# Altium schematic sheet RS-485 Interface.SchDoc
size A; SheetNumber: 6; SheetTotal: 6
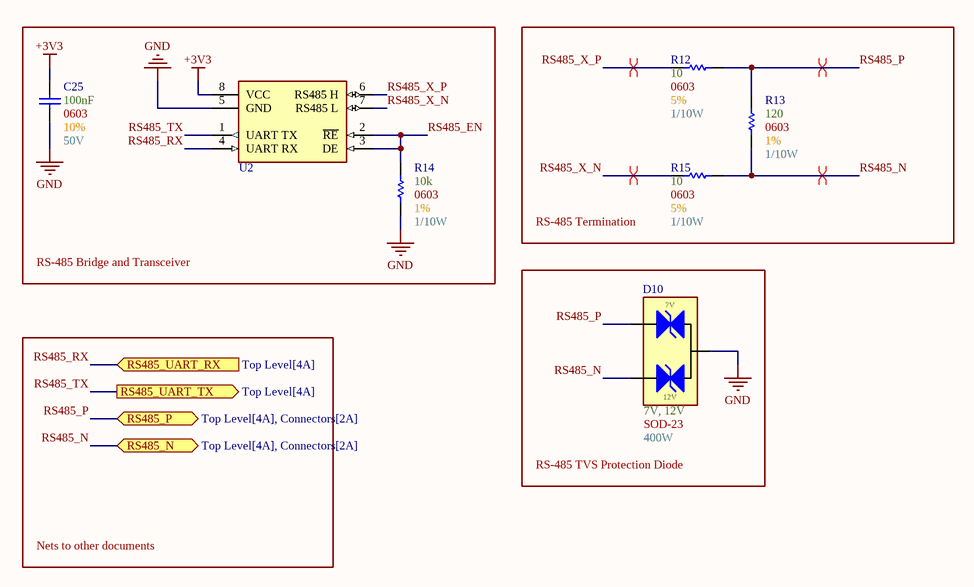
[diagram p0: RS-485 Interface.SchDoc]

## Parts
C25  Max Voltage: 50V  Size Package: 0603  Tolerance: 10%  Capacitance: 100nF  [[Cap] SMD 0603]  (hidden comment: [Cap] 0603 0.1uF 10% 50V)
D10  Wattage: 400W  Optimal Zener Voltage: 7V, 12V  [[Diode] SOD-23]  (hidden comment: SOD-23)
R12  Wattage: 1/10W  Tolerance: 5%  Resistance: 10  Size Package: 0603  [[Res] SMD 0603]  (hidden comment: [10] SMD 0603 5% 1/10W)
R13  Wattage: 1/10W  Tolerance: 1%  Resistance: 120  Size Package: 0603  [[Res] SMD 0603]  (hidden comment: [120] SMD 0603 1% 1/10W)
R14  Wattage: 1/10W  Tolerance: 1%  Resistance: 10k  Size Package: 0603  [[Res] SMD 0603]  (hidden comment: [10k] SMD 0603 1% 1/10W)
R15  Wattage: 1/10W  Tolerance: 5%  Resistance: 10  Size Package: 0603  [[Res] SMD 0603]  (hidden comment: [10] SMD 0603 5% 1/10W)
U2  [Bridge] UART-RS485  [8-SOIC]  (value not drawn)

## Blocks framed on the sheet
RS-485 Bridge and Transceiver: C25 R14 U2
RS-485 Termination: R12 R13 R15
RS-485 TVS Protection Diode: D10

## Ports
RS485_N (bidir, see Top Level[4A], Connectors[2A]), RS485_P (bidir, see Top Level[4A], Connectors[2A]), RS485_UART_RX (in, see Top Level[4A]), RS485_UART_TX (out, see Top Level[4A])

## Nets
+3V3: C25.2 U2.8(VCC)
GND: C25.1 D10.3 R14.1 U2.5(GND)
RS485_EN: R14.2 U2.2(~{RE}) U2.3(DE)
RS485_N: D10.2 R13.1 R15.1 ; port RS485_N
RS485_P: D10.1 R12.1 R13.2 ; port RS485_P
RS485_RX: U2.4(UART_RX) ; port RS485_UART_RX
RS485_TX: U2.1(UART_TX) ; port RS485_UART_TX
RS485_X_N: R15.2 U2.7(RS485_L)
RS485_X_P: R12.2 U2.6(RS485_H)

## Layout directives
differential pair: RS485_N, RS485_P, RS485_X_N, RS485_X_P

## Notes on the sheet
- Nets to other documents
- (in symbol [TVS] 7,12Vnom 11,19Vclamp_max) 7V; 12V

## Library data of the parts
C25 = [Cap] 0603 0.1uF 10% 50V: CL10B104KB8NNNC; Supplier 1: DigiKey; Supplier Part Number 1: 1276-1000-6-ND
D10 = [TVS] 7,12Vnom 11,19Vclamp_max: CDSOT23-SM712; Supplier 1: DigiKey; Supplier Part Number 1: CDSOT23-SM712CT-ND; Footprint: SOD-23
R12 R15 = [10] SMD 0603 5% 1/10W: RC0603JR-1310RL; Supplier 1: DigiKey; Supplier Part Number 1: 13-RC0603JR-1310RLDKR-ND
R13 = [120] SMD 0603 1% 1/10W: RC0603FR-07120RL; Supplier 1: DigiKey; Supplier Part Number 1: 311-120HRDKR-ND
R14 = [10k] SMD 0603 1% 1/10W: RMCF0603FT10K0; Supplier 1: DigiKey; Supplier Part Number 1: RMCF0603FT10K0DKR-ND
U2 = [Bridge] UART-RS485: THVD1400DR; Supplier 1: DigiKey; Supplier Part Number 1: 296-THVD1400DRCT-ND